# EAGLE design auto_F1 (EAGLE 6.5.0)
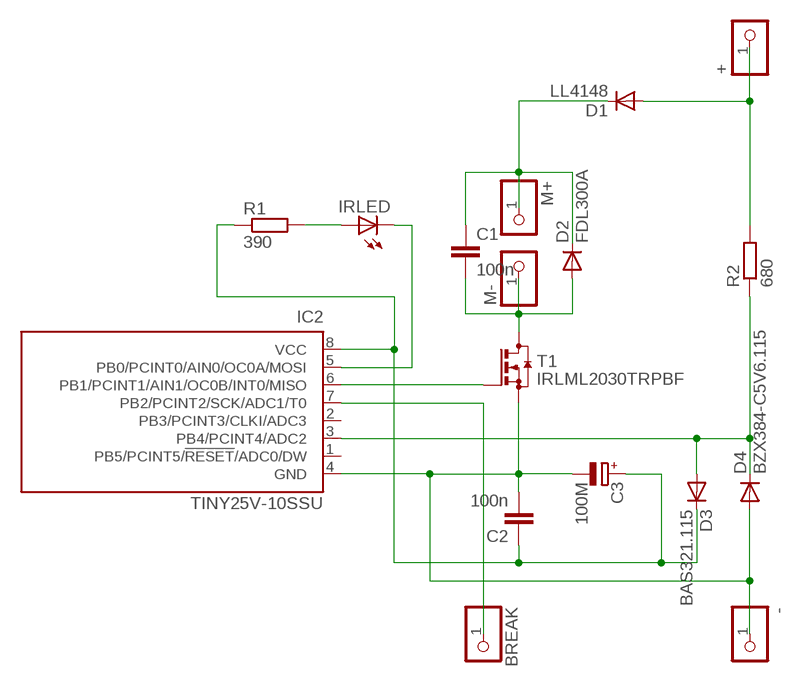
[diagram p0: schematic, sheet 1]

## Parts
+  PINHD-1X1  [1X01]
-  PINHD-1X1  [1X01]
BREAK  PINHD-1X1  [1X01]
C1  100n  C-EUC1206  [C1206]
C2  100n  C-EUC1206  [C1206]
C3  100M  CPOL-EUSMCC  [SMC_C]
D1  LL4148  DIODE-MINIMELF  [MINIMELF]
D2  FDL300A  DIODE-MINIMELF  [MINIMELF]
D3  BAS321.115  DIODE-MICROMELF-W  [MICROMELF-W]
D4  BZX384-C5V6.115  DIODE-MICROMELF-W  [MICROMELF-W]
IC2  TINY25V-10SSU  TINY13-20SSU  [8S1]
IRLED  LED3MM  [LED3MM]
M+  PINHD-1X1  [1X01]
M-  PINHD-1X1  [1X01]
R1  390  R-EU_R1206  [R1206]
R2  680  R-EU_R1206  [R1206]
T1  IRLML2030TRPBF  BSS123  [SOT23]

## Nets
GND: -.1 C2.2 C3.- D4.A IC2.4(GND) T1.2(S)
N$1: IC2.6(PB1/PCINT1/AIN1/OC0B/INT0/MISO) T1.1(G)
N$2: C1.2 D2.A M-.1 T1.3(D)
N$3: C1.1 D1.C D2.C M+.1
N$5: IC2.5(PB0/PCINT0/AIN0/OC0A/MOSI) IRLED.K(C)
N$6: +.1 D1.A R2.2
N$7: IRLED.A R1.2
N$9: D3.A D4.C IC2.3(PB4/PCINT4/ADC2) R2.1
N$12: BREAK.1 IC2.7(PB2/PCINT2/SCK/ADC1/T0)
VCC: C2.1 C3.+ D3.C IC2.8(VCC) R1.1
Unconnected: IC2.1(PB5/PCINT5/!RESET!/ADC0/DW) IC2.2(PB3/PCINT3/CLKI/ADC3)

## Library data of the parts
+ - BREAK M+ M- = pinhead:PINHD-1X1: PIN HEADER
C1 C2 = rcl:C-EU: CAPACITOR, European symbol
C3 = rcl:CPOL-EU: POLARIZED CAPACITOR, European symbol
D1-D4 = diode:DIODE-: DIODE
IC2 = atmel:TINY13: 8-bit AVR Microcontroller with 1K Bytes In-System Programmable Flash Source: http://www.atmel.com/dyn/resources/prod_documents/2535S.pdf; MPN: ATTINY13-20SSU; OC_FARNELL: 1455133; OC_NEWARK: 58M3771
IRLED = led:LED: LED OSRAM: - CHIPLED LG R971, LG N971, LY N971, LG Q971, LY Q971, LO R971, LY R971 LH N974, LH R974 LS Q976, LO Q976, LY Q976 LO Q996 - Hyper CHIPLED LW Q18S LB Q993, LB Q99A, LB R99A - SideLED LS A670, LO A670, LY A670, LG A670, LP A670 LB A673, LV A673, LT A673, LW A673 LH A674 LY A675 LS A676, LA A676, LO A676, LY A676, LW A676 LS A679, LY A679, LG A679 - Hyper Micro SIDELED® LS Y876, LA Y876, LO Y876, LY Y876 LT Y87S - SmartLED LW L88C, LW L88S LB L89C, LB L89S, LG L890 LS L89K, LO L89K, LY L89K LS L896, LA L896, LO L896, LY L896 - TOPLED LS T670, LO T670, LY T670, LG T670, LP T670 LSG T670, LSP T670, LSY T670, LOP T670, LYG T670 LG T671, LOG T671, LSG T671 LB T673, LV T673, LT T673, LW T673 LH T674 LS T676, LA T676, LO T676, LY T676, LB T676, LH T676, LSB T676, LW T676 LB T67C, LV T67C, LT T67C, LS T67K, LO T67K, LY T67K, LW E67C LS E67B, LA E67B, LO E67B, LY E67B, LB E67C, LV E67C, LT E67C LW T67C LS T679, LY T679, LG T679 LS T770, LO T770, LY T770, LG T770, LP T770 LB T773, LV T773, LT T773, LW T773 LH T774 LS E675, LA E675, LY E675, LS T675 LS T776, LA T776, LO T776, LY T776, LB T776 LHGB T686 LT T68C, LB T68C - Hyper Mini TOPLED® LB M676 - Mini TOPLED Santana® LG M470 LS M47K, LO M47K, LY M47K Source: http://www.osram.convergy.de LUXEON: - LUMILED® LXK2-PW12-R00, LXK2-PW12-S00, LXK2-PW14-U00, LXK2-PW14-V00 LXK2-PM12-R00, LXK2-PM12-S00, LXK2-PM14-U00 LXK2-PE12-Q00, LXK2-PE12-R00, LXK2-PE12-S00, LXK2-PE14-T00, LXK2-PE14-U00 LXK2-PB12-K00, LXK2-PB12-L00, LXK2-PB12-M00, LXK2-PB14-N00, LXK2-PB14-P00, LXK2-PB14-Q00 LXK2-PR12-L00, LXK2-PR12-M00, LXK2-PR14-Q00, LXK2-PR14-R00 LXK2-PD12-Q00, LXK2-PD12-R00, LXK2-PD12-S00 LXK2-PH12-R00, LXK2-PH12-S00 LXK2-PL12-P00, LXK2-PL12-Q00, LXK2-PL12-R00 Source: www.luxeon.com KINGBRIGHT: KA-3528ASYC Source: www.kingbright.com
R1 R2 = rcl:R-EU_: RESISTOR, European symbol
T1 = transistor-small-signal:BSS123: N-CHANNEL MOS FET

## Board
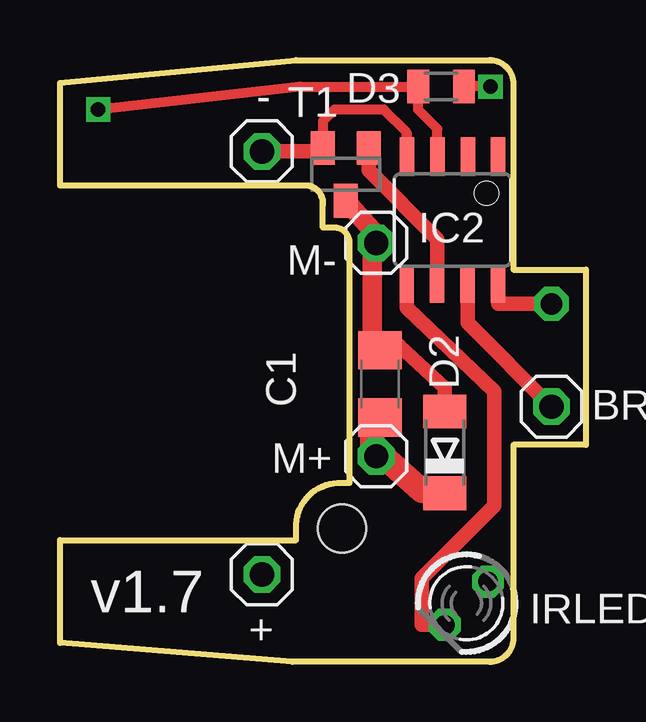
[diagram p1: board, top side]
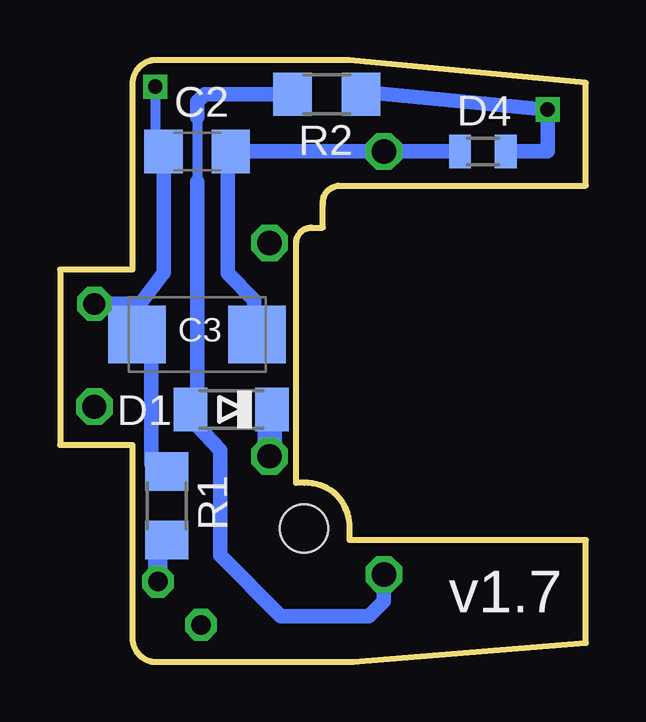
[diagram p2: board, bottom side, seen from below]

Size 21.91 x 25.08 mm. Coordinates in mm from the lower left corner, seen from the top.
Outline: 9.84,25.08 17.89,25.08 arc-90 18.89,24.08 18.89,16.35 21.91,16.35 21.91,9.05 18.89,9.05 18.89,1 arc-90 17.89,0 9.68,0 0,0.79 0,5.08 9.84,5.08 9.84,5.74 arc-90 11.72,7.46 12.06,7.46 12.06,17.46 arc90 11.43,18.1 10.95,18.1 10.95,19.05 arc90 10.32,19.84 0,19.84 0,24.13 9.84,25.08
Copper layers (1*16): Top 0.035mm / dielectric 1.5mm / Bottom 0.035mm
Design rules "default": minimum track width 10mil, minimum drill 24mil, track to track 8mil, track to pad 8mil, pad to pad 8mil, via to via 8mil, smd to smd 8mil, copper to edge 40mil, drill to drill 8mil, minimum pad ring 10mil, minimum via ring 8mil, stop-mask expansion 4mil, vias tented up to drill 0mil, thermal gap 10mil
Holes 2 mm at 11.75,5.56

### Footprints (pad centres in the part's own frame; a part is rotated, then mirrored left to right if it is on the bottom)
1X01 = drill 1.016 octagon: 1 0,0
C1206 = smd 1.6 x 1.8: 1 -1.4,0; 2 1.4,0
SMC_C = smd 2.4 x 2.4: + -2.5,0; - 2.5,0
MINIMELF = smd 1.4 x 1.8: A 1.7,0; C -1.7,0
MICROMELF-W = smd 0.9 x 1.4: A 0.95,0; C -0.95,0
8S1 = smd 0.6 x 1.6: 1 -1.905,-2.654; 2 -0.645,-2.654; 3 0.625,-2.654; 4 1.895,-2.654; 5 1.905,2.654; 6 0.635,2.654; 7 -0.635,2.654; 8 -1.905,2.654
LED3MM = drill 0.813 octagon: A -1.27,0; K 1.27,0
R1206 = smd 1.6 x 1.803: 1 -1.422,0; 2 1.422,0
SOT23 = smd 1 x 1.4: 1 -0.95,-1.1; 2 0.95,-1.1; 3 0,1.1

### Placement (x,y rotation side)
+  8.41,3.65 0 top
-  8.41,21.27 0 top
BREAK  20.48,10.64 0 top
C1  13.33,11.59 90 top
C2  16.19,21.27 0 bottom
C3  16.19,13.65 0 bottom
D1  14.77,10.52 180 bottom
D2  16.03,8.73 90 top
D3  15.88,23.97 180 top
D4  4.29,21.27 180 bottom
IC2  16.35,18.41 180 top
IRLED  16.93,2.45 225 top
M+  13.18,8.57 0 top
M-  13.18,17.46 0 top
R1  17.46,6.51 270 bottom
R2  10.79,23.65 180 bottom
T1  11.91,20.32 180 top

### Tracks (layer width: path | path; a pad name or v marks a point on that pad's centre or on a via)
GND
  Top 0.305: T1.2 10.64,21.74
  Top 0.406: 14.45,22.07 14.45,21.67 | T1.2 10.95,22.54 11.43,23.02 13.49,23.02 14.45,22.07 | T1.2 | 14.45,22.07 14.46,21.74 IC2.4 | T1.2 10.79,21.27
  Top 0.61: 10.79,21.27 -.1
  Bottom 0.61: C2.2 14.76,21.27 | C2.2 15.08,21.46 15.24,21.27 | 15.24,21.27 15.08,20.95 | 15.24,21.27 C2.2 | C2.2 15.11,21.3 15.08,20.95 | 15.08,20.95 14.76,21.27 | C3.- 13.81,13.93 13.81,15.08 14.92,16.19 14.92,21.14 C2.2 | 14.76,21.27 -.1 D4.A
N$1
  Top 0.61: IC2.6 15.72,17.62 12.86,20.48 T1.1
N$2
  Top 0.61: 13.2,13.02 13.2,13.18 C1.2 13.15,13.18 14.13,13.18 16.03,11.43 D2.A
  Top 0.813: C1.2 13.18,13.34 13.02,13.34 13.02,16.83 13.18,17.3 13.02,17.46 | 13.02,17.14 13.02,17.46 | 13.02,17.62 13.02,17.46 | 13.02,17.46 M-.1 13.18,17.79 T1.3
  Top 1.016: 13.2,13.02 C1.2
N$3
  Top 0.61: D2.C 15.56,6.71 15.72,7.14
  Top 1.016: C1.1 13.02,10.16 13.02,8.57 M+.1 13.49,8.57 13.65,8.41 15.08,7.14 15.72,7.14
  Bottom 0.813: D1.C 13.23,10.74 13.02,10.21
  Bottom 1.016: 13.23,10.74 13.18,10.74 M+.1
N$5
  Top 0.61: IC2.5 14.45,14.76 18.1,11.27 18.1,6.51 15.08,3.49 15.08,1.55 IRLED.K
N$6
  Bottom 0.406: 16.51,10.32 16.35,10.64 | 16.35,10 16.11,10.4 16.51,10.4 | 16.19,22.7 16.19,20 | 16.51,10.64 D1.A
  Bottom 0.61: R2.2 15.87,23.65 16.19,23.34 16.19,22.7 | 16.51,10.32 16.51,10.48 | 16.51,10.4 D1.A | 16.19,20 16.19,10.64 D1.A | +.1 8.41,2.54 9.05,1.91 12.7,1.91 15.24,4.45 15.24,8.82 16.19,9.84 16.51,10.79 16.67,10.52 D1.A | 16.35,10.33 D1.A
  Bottom 0.813: 16.35,10.64 16.35,10 | 16.51,10.48 16.51,10.4
N$7
  Bottom 0.813: IRLED.A 17.83,4.56 R1.2
N$9  (via drill 0.6)
  Top 0.406: IC2.3 15.73,22.21 14.92,23.02 D3.A 10,23.97 v1.59,23.02
  Bottom 0.61: D4.C 1.59,21.27 v1.59,23.02 9.56,23.78 9.52,23.81
  Bottom 0.813: 9.56,23.78 R2.1
N$11
  pour Top: 16.83,1.59 16.03,2.38 14.29,0.64 15.88,0.64
N$12
  Top 0.61: IC2.7 16.99,14.13 BREAK.1
N$13
  pour Top: 17.94,2.54 16.99,3.33 18.41,4.6 18.41,3.02
VCC  (via drill 0.6, 0.9 pad 1.42)
  Top 0.406: 16.82,24.02 17.73,24.02 v17.94,23.97
  Top 0.61: 18.26,16.19 IC2.8 18.26,14.92 v20.48,14.92 | 16.82,24.02 16.78,24.02 D3.C
  Bottom 0.406: v17.94,23.97 17.94,21.46 C2.1
  Bottom 0.61: R1.1 17.94,7.94 18.1,8.26 18.1,13.38 C3.+ 18.57,13.77 18.57,14.92 | C2.1 17.59,16.22 18.57,14.92 | 18.57,14.92 v20.48,14.92

### Text on the board
tPlace: v1.7
bPlace: v1.7